# Altium schematic sheet OMT_I2C_Int.SchDoc
size A; Organization: Altium Limited; Address1: L3, 12a Rodborough Rd; Address2: Frenchs Forest; Address3: NSW; Address4: Australia 2086; DocumentNumber: 5; SheetNumber: 5; SheetTotal: 5
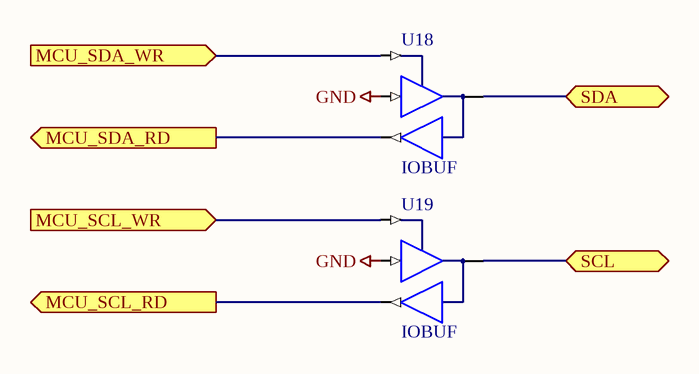
[diagram p0: OMT_I2C_Int.SchDoc]

## Parts
U18  IOBUF
U19  IOBUF

## Ports
MCU_SCL_RD (out), MCU_SCL_WR (in), MCU_SDA_RD (out), MCU_SDA_WR (in), SCL (bidir), SDA (bidir)

## Nets
GND: U18.I U19.I
MCU_SCL_RD: U19.O ; port MCU_SCL_RD
MCU_SCL_WR: U19.T ; port MCU_SCL_WR
MCU_SDA_RD: U18.O ; port MCU_SDA_RD
MCU_SDA_WR: U18.T ; port MCU_SDA_WR
SCL: U19.IO ; port SCL
SDA: U18.IO ; port SDA

## Notes on the sheet
- Title
- Size:
- Date:
- A
- Number:
- Time:
- Revision:
- Sheet
- of
- File:

## Library data of the parts
U18 U19 = IOBUF: Input/Output Buffer; ArchiveName: GENERIC; Published: 7-Nov-2003; Publisher: Altium Limited; Xilinx Equivalent: IOBUF; Core Revision: 1.00.00